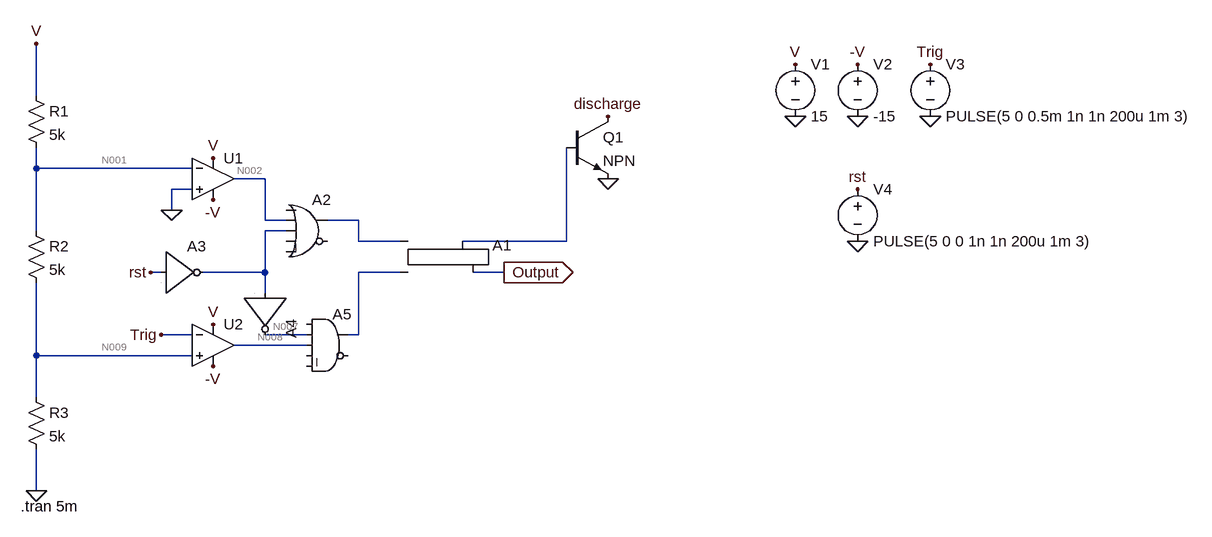
[diagram p0: schematic Draft7.asc]
Draft7.asc, the LTspice schematic file:
Version 4.1
SHEET 1 1740 680
WIRE -64 -32 -64 -112
WIRE -64 80 -64 48
WIRE 176 80 -64 80
WIRE 288 96 240 96
WIRE 176 112 144 112
WIRE 144 144 144 112
WIRE 288 160 288 96
WIRE 320 160 288 160
WIRE 432 160 384 160
WIRE -64 176 -64 80
WIRE 320 176 288 176
WIRE 432 192 432 160
WIRE 496 192 432 192
WIRE 752 192 752 48
WIRE 752 192 592 192
WIRE 128 240 112 240
WIRE 288 240 288 176
WIRE 288 240 192 240
WIRE 496 240 432 240
WIRE 656 240 608 240
WIRE 288 272 288 240
WIRE 176 336 128 336
WIRE 352 336 288 336
WIRE 432 336 432 240
WIRE 432 336 416 336
WIRE 352 352 240 352
WIRE -64 368 -64 256
WIRE 176 368 -64 368
WIRE -64 432 -64 368
WIRE -64 576 -64 512
FLAG -64 576 0
FLAG 208 320 V
FLAG 208 64 V
FLAG 208 128 -V
FLAG 208 384 -V
FLAG 144 144 0
FLAG 128 336 Trig
FLAG 112 240 rst
FLAG 816 96 0
FLAG 816 0 discharge
FLAG 656 240 Output
IOPIN 656 240 Out
FLAG -64 -112 V
FLAG 1104 0 0
FLAG 1200 0 0
FLAG 1312 0 0
FLAG 1104 -80 V
FLAG 1200 -80 -V
FLAG 1312 -80 Trig
FLAG 1200 112 rst
FLAG 1200 192 0
SYMBOL OpAmps\\UniversalOpAmp2 208 96 R0
SYMATTR InstName U1
SYMBOL OpAmps\\UniversalOpAmp2 208 352 R0
SYMATTR InstName U2
SYMBOL res -80 -48 R0
SYMATTR InstName R1
SYMATTR Value 5k
SYMBOL res -80 160 R0
SYMATTR InstName R2
SYMATTR Value 5k
SYMBOL res -80 416 R0
SYMATTR InstName R3
SYMATTR Value 5k
SYMBOL Digital\\srflop 544 144 R0
SYMATTR InstName A1
SYMBOL Digital\\or 352 112 R0
SYMATTR InstName A2
SYMBOL Digital\\inv 128 176 R0
SYMATTR InstName A3
SYMBOL Digital\\inv 352 272 R90
SYMATTR InstName A4
SYMBOL Digital\\and 384 288 R0
SYMATTR InstName A5
SYMBOL npn 752 0 R0
SYMATTR InstName Q1
SYMBOL voltage 1104 -96 R0
SYMATTR InstName V1
SYMATTR Value 15
SYMBOL voltage 1200 -96 R0
SYMATTR InstName V2
SYMATTR Value -15
SYMBOL voltage 1312 -96 R0
WINDOW 123 0 0 Left 0
WINDOW 39 0 0 Left 0
SYMATTR InstName V3
SYMATTR Value PULSE(5 0 0.5m 1n 1n 200u 1m 3)
SYMBOL voltage 1200 96 R0
WINDOW 123 0 0 Left 0
WINDOW 39 0 0 Left 0
SYMATTR InstName V4
SYMATTR Value PULSE(5 0 0 1n 1n 200u 1m 3)
TEXT -88 600 Left 2 !.tran 5m

The netlist it stands for:
* Draft7.asc
X§U1 0 N001 V -V N002 level2 Avol=1Meg GBW=10Meg Slew=10Meg Ilimit=25m Rail=0 Vos=0 En=0 Enk=0 In=0 Ink=0 Rin=500Meg  ; pins In+ In- V+ V- OUT
X§U2 N009 Trig V -V N008 level2 Avol=1Meg GBW=10Meg Slew=10Meg Ilimit=25m Rail=0 Vos=0 En=0 Enk=0 In=0 Ink=0 Rin=500Meg  ; pins In+ In- V+ V- OUT
R1 V N001 5k
R2 N001 N009 5k
R3 N009 0 5k
A1 N003 N006 0 0 0 Output N005 0 SRFLOP
A2 0 N002 N004 0 0 0 N003 0 OR
A3 rst 0 0 0 0 N004 0 0 BUF
A4 N004 0 0 0 0 N007 0 0 BUF
A5 0 N007 N008 0 0 0 N006 0 AND
Q1 discharge N005 0 0 NPN
V1 V 0 15
V2 -V 0 -15
V3 Trig 0 PULSE(5 0 0.5m 1n 1n 200u 1m 3)
V4 rst 0 PULSE(5 0 0 1n 1n 200u 1m 3)
.model NPN NPN
.model PNP PNP
.lib standard.bjt
.tran 5m
.lib UniversalOpAmp2.lib
.backanno
.end

* Results of the author's LTspice run, read from the files saved beside the schematic
* Operating Point, zero values left out:
*   V(v) = 15 V
*   V(n002) = -15 V
*   V(n009) = 5 V
*   V(n008) = -15 V
*   V(output) = 1 V
*   V(rst) = 5 V
*   V(n001) = 10 V
*   V(-v) = -15 V
*   V(trig) = 5 V
*   V(n007) = 1 V
*   I(R2) = 1 mA
*   I(V1) = -1.022 mA
*   I(V3) = -10 nA
*   I(R3) = 1 mA
*   I(R1) = 1 mA
*   I(V2) = 21.8 µA
*   Ix(u2:1) = 10 nA
*   Ix(u2:2) = 10 nA
*   Ix(u2:3) = 18.84 µA
*   Ix(u2:4) = -18.71 µA
*   Ix(u1:2) = 20 nA
*   Ix(u1:3) = 3.34 µA
*   Ix(u1:4) = -3.085 µA
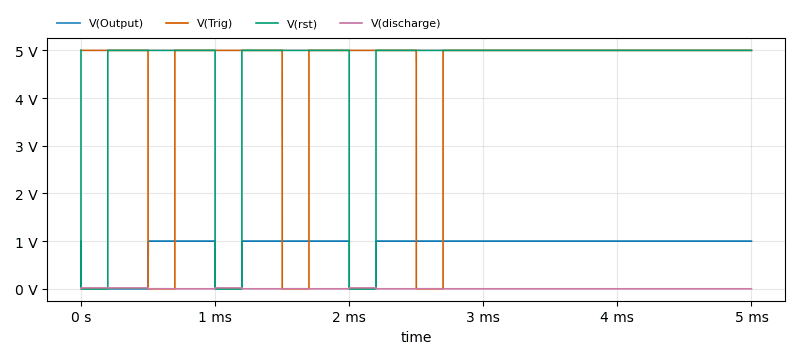
[diagram p1: Transient Analysis of Draft7.asc, plotted from the saved traces]
* Transient Analysis, 1 run:
*   V(Output): min 0 V, max 1 V, average 819.8 mV, rms 905.4 mV, last 1 V
*   V(Trig): min 0 V, max 5 V, average 4.4 V, rms 4.69 V, last 5 V
*   V(rst): min 0 V, max 5 V, average 4.4 V, rms 4.69 V, last 5 V
*   V(discharge): min 0 V, max 17.93 mV, average 3.232 mV, rms 7.611 mV, last 0 V